# Altium schematic sheet MCU.SchDoc
size A
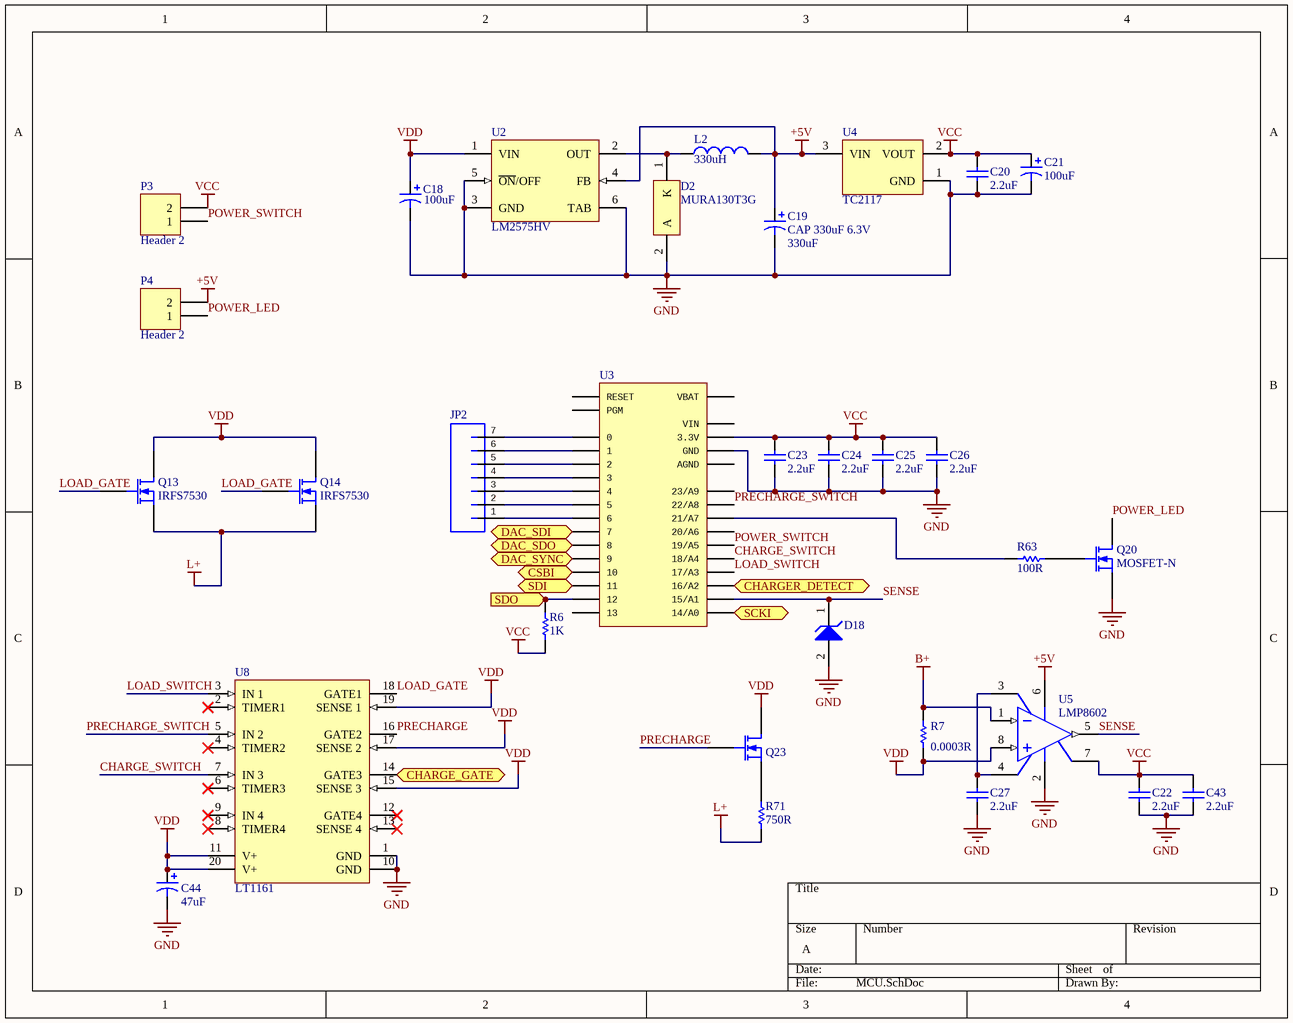
[diagram p0: MCU.SchDoc]

## Parts
C18  value 100uF  [CAP 180uF 50V]
C19  CAP 330uF 6.3V  value 330uF  [CAP 300uF 6.3V]
C20  2.2uF  [CAPC0603(1608)55_N]
C21  100uF  [AVX-CAPC7343_V]
C22  2.2uF  [CAPC0603(1608)55_M]
C23  2.2uF  [CAPC0603(1608)55_N]
C24  2.2uF  [CAPC0603(1608)55_N]
C25  2.2uF  [CAPC0603(1608)55_N]
C26  2.2uF  [CAPC0603(1608)55_N]
C27  2.2uF  [CAPC0603(1608)55_N]
C43  2.2uF  [CAPC0603(1608)55_M]
C44  value 47uF  [CAP 300uF 6.3V]
D2  MURA130T3G  [ONSC-SMA-2-403D-02_V]
D18  (no value)  [ONSC-SOD-323-2-477-02_V]
JP2  (no value)  [JST-7-PTH]
L2  value 330uH  [SDR1307]
P3  Header 2  [HDR1X2]
P4  Header 2  [HDR1X2]
Q13  IRFS7530  [DPAK127P1525X483-7N]
Q14  IRFS7530  [DPAK127P1525X483-7N]
Q20  MOSFET-N  [SOT23-3]
Q23  MOSFET-N  [SOT23-3]  (value not drawn)
R6  1K  [RESC0603(1608)_L]
R7  value 0.0003R  [WSLP5931]
R63  100R  [RESC0603(1608)_L]
R71  750R  [RESC2512(6432)_N]
U2  LM2575HV  [TS5B_L]
U3  (no value)  [TEENSY_3.0_BASIC]
U4  TC2117  [SOT-223-DB3_M]
U5  LMP8602  [M08A_M]
U8  LT1161  [LT-SW-20_M]

## Ports
CHARGE_GATE (out), CHARGER_DETECT (in), CSBI (out), DAC_SDI (out), DAC_SDO (in), DAC_SYNC (out), SCKI (out), SDI (out), SDO (in)

## Nets
+5V: C19.1 L2.2 P4.2 U2.4(FB) U4.3(VIN) U5.6(VS)
B+: R7.2 U5.1(IN-)
GND: C18.2 C19.2 C20.2 C21.2 C22.1 C23.1 C24.1 C25.1 C26.1 C27.1 C43.1 C44.2 D2.2(A) D18.2(A) Q20.3(S) U2.3(GND) U2.5(~{ON}/OFF) U2.6(TAB) U3.GND_GND1(GND) U4.1(GND) U5.2(GND) U8.1(GND) U8.10(GND)
L+: Q13.3(S) Q14.3(S) R71.1
VCC: C20.1 C21.1 C22.2 C23.2 C24.2 C25.2 C26.2 C43.2 P3.2 R6.1 U3.3.3V_3.3V1(3.3V) U4.2(VOUT) U5.7(OFS)
VDD: C18.1 C44.1 Q13.1(D) Q14.1(D) Q23.2(D) R7.1 U2.1(VIN) U5.8(IN+) U8.11(V+) U8.15(SENSE_3) U8.17(SENSE_2) U8.19(SENSE_1) U8.20(V+)
CHARGE_GATE: U8.14(GATE3) ; port CHARGE_GATE
CHARGE_SWITCH: U3.18/A4 U8.7(IN_3)
CHARGER_DETECT: U3.16/A2 ; port CHARGER_DETECT
CSBI: U3.10 ; port CSBI
DAC_SDI: U3.7 ; port DAC_SDI
DAC_SDO: U3.8 ; port DAC_SDO
DAC_SYNC: U3.9 ; port DAC_SYNC
LOAD_GATE: Q13.2(G) Q14.2(G) U8.18(GATE1)
LOAD_SWITCH: U3.17/A3 U8.3(IN_1)
POWER_LED: P4.1 Q20.2(D)
POWER_SWITCH: P3.1 U3.19/A5
PRECHARGE: Q23.1(G) U8.16(GATE2)
PRECHARGE_SWITCH: U3.22/A8 U8.5(IN_2)
SCKI: U3.14/A0 ; port SCKI
SDI: U3.11 ; port SDI
SDO: R6.2 U3.12 ; port SDO
SENSE: D18.1(K) U3.15/A1 U5.5(OUT)
NetC27_2: C27.2 U5.3(A1) U5.4(A2)
NetD2_1: D2.1(K) L2.1 U2.2(OUT)
NetJP2_1: JP2.1 U3.6
NetJP2_2: JP2.2 U3.5
NetJP2_3: JP2.3 U3.4
NetJP2_4: JP2.4 U3.3
NetJP2_5: JP2.5 U3.2
NetJP2_6: JP2.6 U3.1
NetJP2_7: JP2.7 U3.0
NetQ20_1: Q20.1(G) R63.2
NetQ23_3: Q23.3(S) R71.2
NetR63_1: R63.1 U3.21/A7

Not connected (* = marked no-connect by the designer): U3 13 20/A6 23/A9 AGND PGM RESET VBAT VIN; U8 2(TIMER1)* 4(TIMER2)* 6(TIMER3)* 8(TIMER4)* 9(IN_4)* 12(GATE4)* 13(SENSE_4)*

## Library data of the parts
C18 = CAP 100uF 63V: Polarized Capacitor (Axial); Published: 8-Jun-2000; LatestRevisionDate: 17-Jul-2002; LatestRevisionNote: Re-released for DXP Platform.; PackageReference: POLAR0.8; Publisher: Altium Limited; PackageDescription: Polarized Capacitor; 2 Leads
C19 = CAP 330uF 6.3V: Polarized Capacitor (Axial); Published: 8-Jun-2000; LatestRevisionDate: 17-Jul-2002; LatestRevisionNote: Re-released for DXP Platform.; PackageReference: POLAR0.8; Publisher: Altium Limited; PackageDescription: Polarized Capacitor; 2 Leads
C20 C23-C27 = CMP-1035-02762-1: CAP 2.2uF 16V Â±10% 0603 (1608 Metric) Thickness 0.55mm SMD; Case-EIA: 0603; Case-Metric: 1608; Max Thickness: 0.55 mm; Technology: SMT; Value: 2.2uF; Rated Voltage: 16 V; Tolerance: Â±10%
C21 = CMP-0279-00002-1: Capacitor, Tantalum, 220uF 10% 10V MCCT-D (7343-31); PartNumber: TAJD227K010R; Manufacturer: AVX; Polarity: Polarized; ComponentLink2URL: http://www.avx.com/docs/Catalogs/taj.pdf; PackageReference: CAPC7343; ComponentLink2Description: Datasheet; ComponentLink1URL: http://www.avx.com/; Mounting Technology: Surface Mount; Technology: Tantalum; Tolerance: 10%; Capacitance: 220uF; Rated Voltage: 10V; PackageDescription: 2-Pin SMT Capacitor, 7.3 x 4.3 mm Body; ComponentLink1Description: Manufacturer URL; DatasheetVersion: Jul-13
C22 C43 = CMP-1035-02751-1: CAP 2.2uF 4V Â±10% 0603 (1608 Metric) Thickness 0.55mm SMD; Case-EIA: 0603; Case-Metric: 1608; Tolerance: Â±10%; Rated Voltage: 4 V; Technology: SMT; Max Thickness: 0.55 mm; Value: 2.2uF
C44 = CAP 47uF 50V: Polarized Capacitor (Axial); Published: 8-Jun-2000; LatestRevisionDate: 17-Jul-2002; LatestRevisionNote: Re-released for DXP Platform.; PackageReference: POLAR0.8; Publisher: Altium Limited; PackageDescription: Polarized Capacitor; 2 Leads
D2 = CMP-0902-00297-1: Surface Mount Ultrafast Power Rectifier, 2-Pin SMA, Pb-Free, Tape and Reel; Manufacturer: On Semiconductor; IFSM Max (A): 35; PackageDescription: 2-Pin Small Molded Package, J-Bend Lead, Body 2.605 x 4.315 mm; ComponentLink1URL: http://www.onsemi.com/; ComponentLink2Description: Datasheet; PackageVersion: Rev. G, 07/2012; PackageReference: SMA-2-403D-02; DatasheetVersion: Rev. 5; Packing: Tape and Reel; ComponentLink2URL: http://www.onsemi.cn/pub_link/Collateral/MURA130T3-D.PDF; Type: Ultrafast; RoHS: TRUE; ComponentLink1Description: Manufacturer URL; ComponentLink3Description: Package Specification; ComponentLink3URL: http://www.onsemi.com/pub_link/Collateral/403D-02.PDF; Mounting Technology: Surface Mount; PartNumber: MURA130T3G
D18 = CMP-1060-00652-1: Zener Voltage Regulator, 300 mW, Tight Tolerance Portfolio, 2-Pin SOD-323, Pb-Free, Tape and Reel; PartNumber: MM3Z3V3ST1G; Manufacturer: On Semiconductor; P Max (W): 0.3; DatasheetVersion: Rev. 21; PackageVersion: Rev. H, 03/2007; Packing: Tape and Reel; PackageReference: SOD-323-2-477-02; RoHS: Pb-Free; Mounting Technology: Surface Mount; ComponentLink2URL: http://www.onsemi.cn/pub_link/Collateral/MM3Z2V4ST1-D.PDF; ComponentLink1URL: http://www.onsemi.com/; ComponentLink2Description: Datasheet; ComponentLink1Description: Manufacturer URL; ComponentLink3Description: Package Specification; PackageDescription: 2-Pin SOD, Body 1.7 x 1.25 mm; ComponentLink3URL: http://www.onsemi.com/pub_link/Collateral/477-02.PDF.1
JP2 = JST_7_RIGHT
L2 = SDR1307-331KL: Inductor; Code_IEC: 1005; Published: 8-Jun-2000; LatestRevisionDate: 29-May-2009; LatestRevisionNote: IPC-7351 Footprint Added.; PackageReference: 0402-A; Publisher: Altium Limited; PackageDescription: Chip Inductor; Code_JEITA: 0402
P3 P4 = Header 2: Header, 2-Pin; LatestRevisionDate: 17-Jul-2002; LatestRevisionNote: Re-released for DXP Platform.; Publisher: Altium Limited
Q13 Q14 = IRFS7530: N-Channel MOSFET; pin to pad: 1>8 2>1 3>2+3+5+6+7; Published: 8-Jun-2000; LatestRevisionDate: 17-Jul-2002; LatestRevisionNote: Re-released for DXP Platform.; PackageVersion: 1995/1996; PackageReference: E3; Publisher: Altium Limited; PackageDescription: TO, Flat Index; 3 In-Line, Axial Leads; Body Dia. 4.6mm; Lead Dia. 0.5 mm (max)
Q20 Q23 = MOSFET-N: N-Channel MOSFET; Published: 8-Jun-2000; LatestRevisionDate: 17-Jul-2002; LatestRevisionNote: Re-released for DXP Platform.; PackageVersion: 1995/1996; PackageReference: E3; Publisher: Altium Limited; PackageDescription: TO, Flat Index; 3 In-Line, Axial Leads; Body Dia. 4.6mm; Lead Dia. 0.5 mm (max)
R6 = CMP-1012-00074-1: 1K 0.1W 5% 0603 (1608 Metric)  SMD; Case-EIA: 0603; Case-Metric: 1608; Value: 1000.00 Ohm; Technology: SMT; Tolerance: 5 %; Power: 0.1 W
R7 = SHUNT: Resistor; Published: 8-Jun-2000; LatestRevisionDate: 17-Jul-2002; LatestRevisionNote: Re-released for DXP Platform.; PackageReference: AXIAL-0.3; Publisher: Altium Limited; PackageDescription: Axial Device, Thru-Hole; 2 Leads; 0.3 in Pin Spacing
R63 = CMP-1012-00050-1: 100R 0.1W 5% 0603 (1608 Metric)  SMD; Case-EIA: 0603; Value: 100.00 Ohm; Case-Metric: 1608; Tolerance: 5 %; Technology: SMT; Power: 0.1 W
R71 = CMP-1018-00496-1: 750R 1W 1% 2512 (6432 Metric)  SMD; Value: 750.00 Ohm; Case-EIA: 2512; Case-Metric: 6432; Tolerance: 1 %; Technology: SMT; Power: 1 W
U2 = CMP-0069-00099-2: SIMPLE SWITCHERÂ® 1A Step-Down Voltage Regulator, 5-pin TO-263, Pb-Free; Manufacturer: National Semiconductor; PackageTopMarking: NSUZXYTTE#*LM2575HVS*-5.0 P+; PowerWise: N; ComponentLink1URL: http://www.national.com/ds/LM/LM2575HV.pdf; ComponentLink2Description: LM2575HV Web Page; ComponentLink1Description: LM2575HV Datasheet; ComponentLink3URL: http://www.national.com/packaging/folders/ts5b.html; DatasheetVersion: Apr-2007; ComponentLink2URL: http://www.national.com/pf/LM/LM2575HV.html; PackageDescription: TO-263, Molded, .400 x .390 x .180in, 5 Lead, .067in Pitch, Surface Mount; PackageVersion: revD, Apr-2005; RoHS: Y; PackageReference: TS5B; CompType: Switcher; Code_JEDEC: MO-169-AB; ComponentLink3Description: TS5B Package Page; RevisionNote: Component URLs added; PinCount: 5
U3 = TEENSY_3.0_BASIC: pin to pad: 3.3V 3.3V1>3.3V+3.3V1 GND GND1>GND+GND1
U4 = PM-LINEREG-TC2117-IL4
U5 = CMP-0055-00659-1: 60V Common Mode, 50 x Gain, Bidirectional Precision Current Sensing Amplifier, 8 pin SOIC NARROW; Manufacturer: National Semiconductor; PowerWise: N; CompType: Amplifiers; PackageTopMarking: NSZXTT*LMP86*02QMA; Code_JEDEC: MS-012-AA; PackageDescription: SOIC Narrow, 4.9 x 3.9 x 1.45mm, 8 Lead, 1.27mm Pitch; RoHS: Y; PinCount: 8; PackageVersion: revM, May-2009; Code_IPC: SOIC127P600-8; DatasheetVersion: Mar-2010; PackageReference: M08A
U8 = CMP-0479-00631-1: Quad Protected High-Side MOSFET Driver, 8 to 48 V Vin, 20-pin SOIC (SW-20), -40 to 85 degC, Pb-Free; Manufacturer: Linear Technology; PartNumber: LT1161ISW#PBF; ComponentLink3URL: http://cds.linear.com/docs/en/packaging/SO_20_05-08-1620.pdf; RoHS: TRUE; ComponentLink1URL: http://www.linear.com/; PackageDescription: 20-Pin Plastic Small Outline, Body 12.80 x 7.49 mm, Pitch 1.27 mm; DatasheetVersion: Rev. A; ComponentLink1Description: Manufacturer URL; ComponentLink3Description: Package Specification; ComponentLink2URL: http://cds.linear.com/docs/en/datasheet/1161fa.pdf; PackageReference: SW-20; PackageVersion: Jun-10; ComponentLink2Description: Datasheet; Mounting Technology: Surface Mount